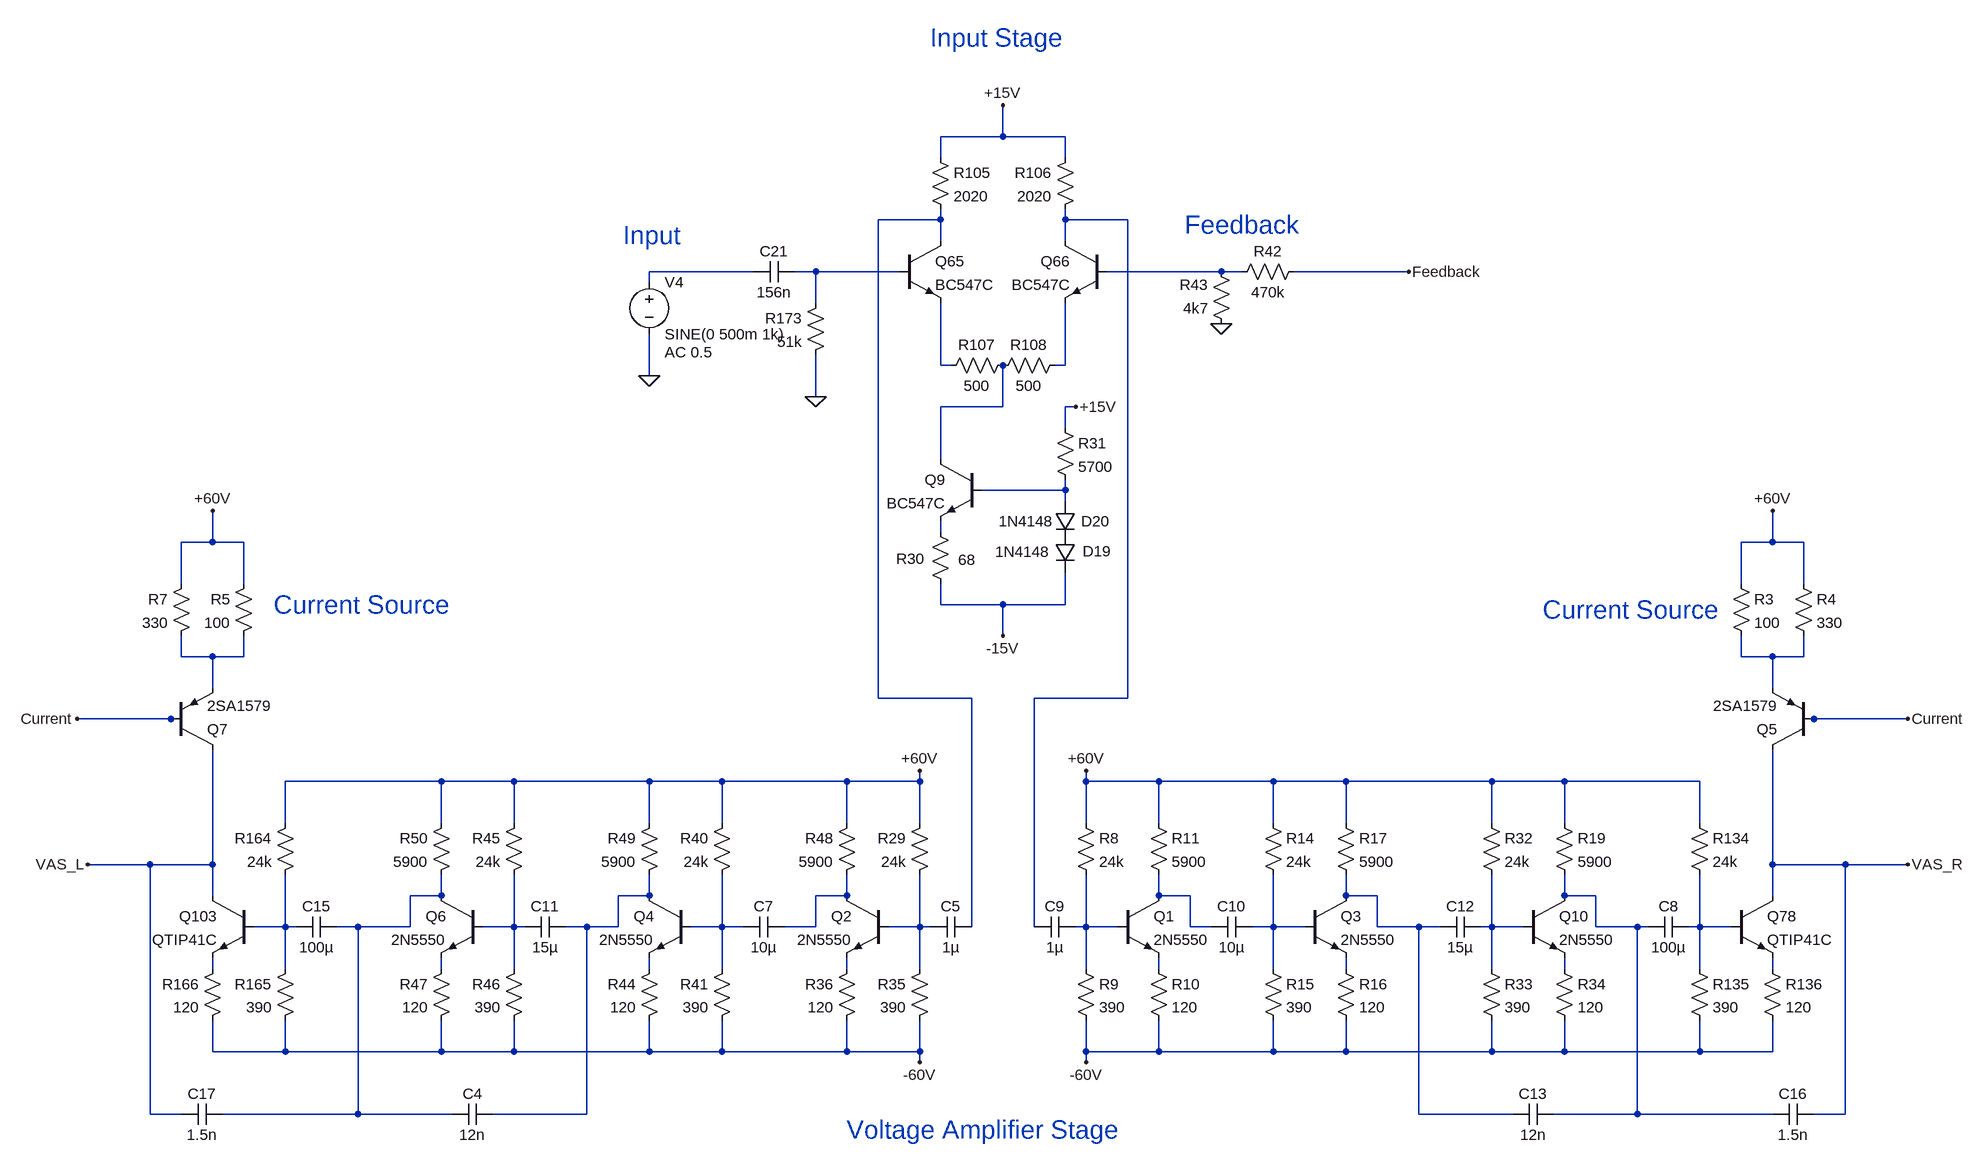
[diagram p0: schematic V12_TEX1.asc]
V12_TEX1.asc, the LTspice schematic file:
Version 4
SHEET 1 16980 8052
WIRE 7760 4400 7760 4352
WIRE 7760 4400 7664 4400
WIRE 7856 4400 7760 4400
WIRE 7664 4432 7664 4400
WIRE 7856 4432 7856 4400
WIRE 7664 4528 7664 4512
WIRE 7664 4528 7568 4528
WIRE 7856 4528 7856 4512
WIRE 7952 4528 7856 4528
WIRE 7664 4560 7664 4528
WIRE 7856 4560 7856 4528
WIRE 7376 4608 7216 4608
WIRE 7472 4608 7440 4608
WIRE 7600 4608 7472 4608
WIRE 8096 4608 7920 4608
WIRE 8128 4608 8096 4608
WIRE 8384 4608 8208 4608
WIRE 7216 4624 7216 4608
WIRE 7472 4656 7472 4608
WIRE 7664 4752 7664 4656
WIRE 7680 4752 7664 4752
WIRE 7856 4752 7856 4656
WIRE 7856 4752 7840 4752
WIRE 7216 4768 7216 4704
WIRE 7472 4800 7472 4736
WIRE 7760 4816 7760 4752
WIRE 7760 4816 7664 4816
WIRE 7872 4816 7856 4816
WIRE 7856 4848 7856 4816
WIRE 7664 4896 7664 4816
WIRE 7856 4944 7856 4928
WIRE 7856 4944 7728 4944
WIRE 7856 4960 7856 4944
WIRE 7664 5008 7664 4992
WIRE 6544 5024 6544 4976
WIRE 6544 5024 6496 5024
WIRE 6592 5024 6544 5024
WIRE 7856 5024 7856 5008
WIRE 8944 5024 8944 4976
WIRE 8944 5024 8896 5024
WIRE 8992 5024 8944 5024
WIRE 6496 5088 6496 5024
WIRE 6592 5088 6592 5024
WIRE 8896 5088 8896 5024
WIRE 8992 5088 8992 5024
WIRE 7664 5120 7664 5088
WIRE 7760 5120 7664 5120
WIRE 7856 5120 7856 5072
WIRE 7856 5120 7760 5120
WIRE 7760 5168 7760 5120
WIRE 6496 5200 6496 5168
WIRE 6544 5200 6496 5200
WIRE 6592 5200 6592 5168
WIRE 6592 5200 6544 5200
WIRE 8896 5200 8896 5168
WIRE 8944 5200 8896 5200
WIRE 8992 5200 8992 5168
WIRE 8992 5200 8944 5200
WIRE 6544 5248 6544 5200
WIRE 8944 5248 8944 5200
WIRE 7568 5264 7568 4528
WIRE 7712 5264 7568 5264
WIRE 7952 5264 7952 4528
WIRE 7952 5264 7808 5264
WIRE 6480 5296 6336 5296
WIRE 6496 5296 6480 5296
WIRE 9008 5296 8992 5296
WIRE 9152 5296 9008 5296
WIRE 6896 5392 6656 5392
WIRE 7008 5392 6896 5392
WIRE 7216 5392 7008 5392
WIRE 7328 5392 7216 5392
WIRE 7520 5392 7328 5392
WIRE 7632 5392 7632 5376
WIRE 7632 5392 7520 5392
WIRE 7888 5392 7888 5376
WIRE 8000 5392 7888 5392
WIRE 8176 5392 8000 5392
WIRE 8288 5392 8176 5392
WIRE 8512 5392 8288 5392
WIRE 8624 5392 8512 5392
WIRE 8832 5392 8624 5392
WIRE 6656 5456 6656 5392
WIRE 6896 5456 6896 5392
WIRE 7008 5456 7008 5392
WIRE 7216 5456 7216 5392
WIRE 7328 5456 7328 5392
WIRE 7520 5456 7520 5392
WIRE 7632 5456 7632 5392
WIRE 7888 5456 7888 5392
WIRE 8000 5456 8000 5392
WIRE 8176 5456 8176 5392
WIRE 8288 5456 8288 5392
WIRE 8512 5456 8512 5392
WIRE 8624 5456 8624 5392
WIRE 8832 5456 8832 5392
WIRE 6448 5520 6352 5520
WIRE 6544 5520 6544 5344
WIRE 6544 5520 6448 5520
WIRE 8944 5520 8944 5344
WIRE 9056 5520 8944 5520
WIRE 9152 5520 9056 5520
WIRE 6544 5568 6544 5520
WIRE 6896 5568 6896 5536
WIRE 6896 5568 6848 5568
WIRE 7216 5568 7216 5536
WIRE 7216 5568 7168 5568
WIRE 7520 5568 7520 5536
WIRE 7520 5568 7472 5568
WIRE 8000 5568 8000 5536
WIRE 8048 5568 8000 5568
WIRE 8288 5568 8288 5536
WIRE 8336 5568 8288 5568
WIRE 8624 5568 8624 5536
WIRE 8672 5568 8624 5568
WIRE 8944 5568 8944 5520
WIRE 6656 5616 6656 5536
WIRE 6656 5616 6608 5616
WIRE 6672 5616 6656 5616
WIRE 6768 5616 6736 5616
WIRE 6848 5616 6848 5568
WIRE 6848 5616 6768 5616
WIRE 7008 5616 7008 5536
WIRE 7008 5616 6960 5616
WIRE 7024 5616 7008 5616
WIRE 7120 5616 7088 5616
WIRE 7168 5616 7168 5568
WIRE 7168 5616 7120 5616
WIRE 7328 5616 7328 5536
WIRE 7328 5616 7280 5616
WIRE 7360 5616 7328 5616
WIRE 7472 5616 7472 5568
WIRE 7472 5616 7424 5616
WIRE 7632 5616 7632 5536
WIRE 7632 5616 7584 5616
WIRE 7648 5616 7632 5616
WIRE 7712 5616 7712 5264
WIRE 7808 5616 7808 5264
WIRE 7888 5616 7888 5536
WIRE 7888 5616 7872 5616
WIRE 7936 5616 7888 5616
WIRE 8048 5616 8048 5568
WIRE 8080 5616 8048 5616
WIRE 8176 5616 8176 5536
WIRE 8176 5616 8144 5616
WIRE 8224 5616 8176 5616
WIRE 8336 5616 8336 5568
WIRE 8400 5616 8336 5616
WIRE 8432 5616 8400 5616
WIRE 8512 5616 8512 5536
WIRE 8512 5616 8496 5616
WIRE 8560 5616 8512 5616
WIRE 8672 5616 8672 5568
WIRE 8736 5616 8672 5616
WIRE 8752 5616 8736 5616
WIRE 8832 5616 8832 5536
WIRE 8832 5616 8816 5616
WIRE 8880 5616 8832 5616
WIRE 6544 5680 6544 5664
WIRE 6656 5680 6656 5616
WIRE 6896 5680 6896 5664
WIRE 7008 5680 7008 5616
WIRE 7216 5680 7216 5664
WIRE 7328 5680 7328 5616
WIRE 7520 5680 7520 5664
WIRE 7632 5680 7632 5616
WIRE 7888 5680 7888 5616
WIRE 8000 5680 8000 5664
WIRE 8176 5680 8176 5616
WIRE 8288 5680 8288 5664
WIRE 8512 5680 8512 5616
WIRE 8624 5680 8624 5664
WIRE 8832 5680 8832 5616
WIRE 8944 5680 8944 5664
WIRE 6544 5808 6544 5760
WIRE 6656 5808 6656 5760
WIRE 6656 5808 6544 5808
WIRE 6896 5808 6896 5760
WIRE 6896 5808 6656 5808
WIRE 7008 5808 7008 5760
WIRE 7008 5808 6896 5808
WIRE 7216 5808 7216 5760
WIRE 7216 5808 7008 5808
WIRE 7328 5808 7328 5760
WIRE 7328 5808 7216 5808
WIRE 7520 5808 7520 5760
WIRE 7520 5808 7328 5808
WIRE 7632 5808 7632 5760
WIRE 7632 5808 7520 5808
WIRE 7888 5808 7888 5760
WIRE 8000 5808 8000 5760
WIRE 8000 5808 7888 5808
WIRE 8176 5808 8176 5760
WIRE 8176 5808 8000 5808
WIRE 8288 5808 8288 5760
WIRE 8288 5808 8176 5808
WIRE 8512 5808 8512 5760
WIRE 8512 5808 8288 5808
WIRE 8624 5808 8624 5760
WIRE 8624 5808 8512 5808
WIRE 8832 5808 8832 5760
WIRE 8832 5808 8624 5808
WIRE 8944 5808 8944 5760
WIRE 8944 5808 8832 5808
WIRE 7632 5824 7632 5808
WIRE 7888 5824 7888 5808
WIRE 6448 5904 6448 5520
WIRE 6496 5904 6448 5904
WIRE 6768 5904 6768 5616
WIRE 6768 5904 6560 5904
WIRE 6912 5904 6768 5904
WIRE 7120 5904 7120 5616
WIRE 7120 5904 6976 5904
WIRE 8400 5904 8400 5616
WIRE 8544 5904 8400 5904
WIRE 8736 5904 8736 5616
WIRE 8736 5904 8608 5904
WIRE 8944 5904 8736 5904
WIRE 9056 5904 9056 5520
WIRE 9056 5904 9008 5904
FLAG 7760 4352 +15V
FLAG 7216 4768 0
FLAG 7472 4800 0
FLAG 7760 5168 -15V
FLAG 7872 4816 +15V
FLAG 7888 5376 +60V
FLAG 7888 5824 -60V
FLAG 8096 4688 0
FLAG 7632 5376 +60V
FLAG 7632 5824 -60V
FLAG 9152 5296 Current
FLAG 6336 5296 Current
FLAG 8944 4976 +60V
FLAG 6544 4976 +60V
FLAG 9152 5520 VAS_R
FLAG 6352 5520 VAS_L
FLAG 8384 4608 Feedback
SYMBOL npn 7600 4560 R0
SYMATTR InstName Q65
SYMATTR Value BC547C
SYMBOL npn 7920 4560 M0
SYMATTR InstName Q66
SYMATTR Value BC547C
SYMBOL res 7648 4416 R0
SYMATTR InstName R105
SYMATTR Value 2020
SYMBOL res 7872 4416 M0
SYMATTR InstName R106
SYMATTR Value 2020
SYMBOL res 7776 4736 R90
WINDOW 0 0 56 VBottom 2
WINDOW 3 32 56 VTop 2
SYMATTR InstName R107
SYMATTR Value 500
SYMBOL res 7856 4736 R90
WINDOW 0 0 56 VBottom 2
WINDOW 3 32 56 VTop 2
SYMATTR InstName R108
SYMATTR Value 500
SYMBOL res 8816 5440 R0
SYMATTR InstName R134
SYMATTR Value 24k
SYMBOL res 8816 5664 R0
SYMATTR InstName R135
SYMATTR Value 390
SYMBOL npn 8880 5568 R0
SYMATTR InstName Q78
SYMATTR Value QTIP41C
SYMBOL res 8928 5664 R0
SYMATTR InstName R136
SYMATTR Value 120
SYMBOL cap 9008 5888 R90
WINDOW 0 0 32 VBottom 2
WINDOW 3 32 32 VTop 2
SYMATTR InstName C16
SYMATTR Value 1.5n
SYMATTR SpiceLine Rser=0.1
SYMBOL res 6672 5440 M0
SYMATTR InstName R164
SYMATTR Value 24k
SYMBOL res 6672 5664 M0
SYMATTR InstName R165
SYMATTR Value 390
SYMBOL npn 6608 5568 M0
SYMATTR InstName Q103
SYMATTR Value QTIP41C
SYMBOL res 6560 5664 M0
SYMATTR InstName R166
SYMATTR Value 120
SYMBOL cap 6496 5888 M90
WINDOW 0 0 32 VBottom 2
WINDOW 3 32 32 VTop 2
SYMATTR InstName C17
SYMATTR Value 1.5n
SYMATTR SpiceLine Rser=0.1
SYMBOL voltage 7216 4608 R0
WINDOW 123 24 124 Left 2
WINDOW 39 0 0 Left 0
SYMATTR Value2 AC 0.5
SYMATTR InstName V4
SYMATTR Value SINE(0 500m 1k)
SYMBOL cap 7440 4592 R90
WINDOW 0 0 32 VBottom 2
WINDOW 3 32 32 VTop 2
SYMATTR InstName C21
SYMATTR Value 156n
SYMATTR SpiceLine Rser=0.1
SYMBOL res 7488 4640 M0
SYMATTR InstName R173
SYMATTR Value 51k
SYMBOL diode 7872 5008 M0
WINDOW 0 -55 30 Left 2
WINDOW 3 39 31 Left 2
SYMATTR InstName D19
SYMATTR Value 1N4148
SYMBOL diode 7872 4960 M0
WINDOW 0 -53 32 Left 2
WINDOW 3 34 32 Left 2
SYMATTR InstName D20
SYMATTR Value 1N4148
SYMBOL npn 7728 4896 M0
SYMATTR InstName Q9
SYMATTR Value BC547C
SYMBOL res 7648 4992 R0
WINDOW 0 -52 58 Left 2
WINDOW 3 43 59 Left 2
SYMATTR InstName R30
SYMATTR Value 68
SYMBOL res 7840 4832 R0
SYMATTR InstName R31
SYMATTR Value 5700
SYMBOL res 7872 5440 R0
SYMATTR InstName R8
SYMATTR Value 24k
SYMBOL res 7872 5664 R0
SYMATTR InstName R9
SYMATTR Value 390
SYMBOL npn 7936 5568 R0
SYMATTR InstName Q1
SYMATTR Value 2N5550
SYMBOL res 7984 5664 R0
SYMATTR InstName R10
SYMATTR Value 120
SYMBOL res 8160 5440 R0
SYMATTR InstName R14
SYMATTR Value 24k
SYMBOL res 8160 5664 R0
SYMATTR InstName R15
SYMATTR Value 390
SYMBOL npn 8224 5568 R0
SYMATTR InstName Q3
SYMATTR Value 2N5550
SYMBOL res 8272 5664 R0
SYMATTR InstName R16
SYMATTR Value 120
SYMBOL res 8496 5440 R0
SYMATTR InstName R32
SYMATTR Value 24k
SYMBOL res 8496 5664 R0
SYMATTR InstName R33
SYMATTR Value 390
SYMBOL npn 8560 5568 R0
SYMATTR InstName Q10
SYMATTR Value 2N5550
SYMBOL res 8608 5664 R0
SYMATTR InstName R34
SYMATTR Value 120
SYMBOL res 8224 4592 R90
WINDOW 0 0 56 VBottom 2
WINDOW 3 32 56 VTop 2
SYMATTR InstName R42
SYMATTR Value 470k
SYMBOL res 8112 4704 R180
WINDOW 0 36 76 Left 2
WINDOW 3 36 40 Left 2
SYMATTR InstName R43
SYMATTR Value 4k7
SYMBOL res 7984 5440 R0
SYMATTR InstName R11
SYMATTR Value 5900
SYMBOL res 8272 5440 R0
SYMATTR InstName R17
SYMATTR Value 5900
SYMBOL res 8608 5440 R0
SYMATTR InstName R19
SYMATTR Value 5900
SYMBOL cap 8544 5888 M90
WINDOW 0 0 32 VBottom 2
WINDOW 3 32 32 VTop 2
SYMATTR InstName C13
SYMATTR Value 12n
SYMATTR SpiceLine Rser=0.1
SYMBOL cap 8752 5600 M90
WINDOW 0 0 32 VBottom 2
WINDOW 3 32 32 VTop 2
SYMATTR InstName C8
SYMATTR Value 100µ
SYMATTR SpiceLine Rser=0.1
SYMBOL cap 6672 5600 M90
WINDOW 0 0 32 VBottom 2
WINDOW 3 32 32 VTop 2
SYMATTR InstName C15
SYMATTR Value 100µ
SYMATTR SpiceLine Rser=0.1
SYMBOL cap 7872 5600 R90
WINDOW 0 0 32 VBottom 2
WINDOW 3 32 32 VTop 2
SYMATTR InstName C9
SYMATTR Value 1µ
SYMBOL cap 8144 5600 R90
WINDOW 0 0 32 VBottom 2
WINDOW 3 32 32 VTop 2
SYMATTR InstName C10
SYMATTR Value 10µ
SYMBOL cap 8496 5600 R90
WINDOW 0 0 32 VBottom 2
WINDOW 3 32 32 VTop 2
SYMATTR InstName C12
SYMATTR Value 15µ
SYMBOL res 7648 5440 M0
SYMATTR InstName R29
SYMATTR Value 24k
SYMBOL res 7648 5664 M0
SYMATTR InstName R35
SYMATTR Value 390
SYMBOL npn 7584 5568 M0
SYMATTR InstName Q2
SYMATTR Value 2N5550
SYMBOL res 7536 5664 M0
SYMATTR InstName R36
SYMATTR Value 120
SYMBOL res 7344 5440 M0
SYMATTR InstName R40
SYMATTR Value 24k
SYMBOL res 7344 5664 M0
SYMATTR InstName R41
SYMATTR Value 390
SYMBOL npn 7280 5568 M0
SYMATTR InstName Q4
SYMATTR Value 2N5550
SYMBOL res 7232 5664 M0
SYMATTR InstName R44
SYMATTR Value 120
SYMBOL res 7024 5440 M0
SYMATTR InstName R45
SYMATTR Value 24k
SYMBOL res 7024 5664 M0
SYMATTR InstName R46
SYMATTR Value 390
SYMBOL npn 6960 5568 M0
SYMATTR InstName Q6
SYMATTR Value 2N5550
SYMBOL res 6912 5664 M0
SYMATTR InstName R47
SYMATTR Value 120
SYMBOL res 7536 5440 M0
SYMATTR InstName R48
SYMATTR Value 5900
SYMBOL res 7232 5440 M0
SYMATTR InstName R49
SYMATTR Value 5900
SYMBOL res 6912 5440 M0
SYMATTR InstName R50
SYMATTR Value 5900
SYMBOL cap 6976 5888 R90
WINDOW 0 0 32 VBottom 2
WINDOW 3 32 32 VTop 2
SYMATTR InstName C4
SYMATTR Value 12n
SYMATTR SpiceLine Rser=0.1
SYMBOL cap 7648 5600 M90
WINDOW 0 0 32 VBottom 2
WINDOW 3 32 32 VTop 2
SYMATTR InstName C5
SYMATTR Value 1µ
SYMBOL cap 7360 5600 M90
WINDOW 0 0 32 VBottom 2
WINDOW 3 32 32 VTop 2
SYMATTR InstName C7
SYMATTR Value 10µ
SYMBOL cap 7024 5600 M90
WINDOW 0 0 32 VBottom 2
WINDOW 3 32 32 VTop 2
SYMATTR InstName C11
SYMATTR Value 15µ
SYMBOL pnp 9008 5344 R180
SYMATTR InstName Q5
SYMATTR Value 2SA1579
SYMBOL res 8880 5072 R0
SYMATTR InstName R3
SYMATTR Value 100
SYMBOL res 8976 5072 R0
SYMATTR InstName R4
SYMATTR Value 330
SYMBOL pnp 6480 5344 M180
SYMATTR InstName Q7
SYMATTR Value 2SA1579
SYMBOL res 6608 5072 M0
SYMATTR InstName R5
SYMATTR Value 100
SYMBOL res 6512 5072 M0
SYMATTR InstName R7
SYMATTR Value 330
TEXT 7520 5928 Left 4 ;Voltage Amplifier Stage
TEXT 7648 4248 Left 4 ;Input Stage
TEXT 8040 4536 Left 4 ;Feedback
TEXT 6912 5120 Right 4 ;Current Source
TEXT 8864 5128 Right 4 ;Current Source
TEXT 7176 4552 Left 4 ;Input

The netlist it stands for:
* V12_TEX1.asc
Q65 N001 N004 N006 0 BC547C
Q66 N002 N005 N007 0 BC547C
R105 +15V N001 2020
R106 +15V N002 2020
R107 N008 N006 500
R108 N007 N008 500
R134 +60V N027 24k
R135 N027 -60V 390
Q78 VAS_R N027 N035 0 QTIP41C
R136 N035 -60V 120
C16 VAS_R N019 1.5n Rser=0.1
R164 +60V N020 24k
R165 N020 -60V 390
Q103 VAS_L N020 N028 0 QTIP41C
R166 N028 -60V 120
C17 VAS_L N014 1.5n Rser=0.1
V4 N003 0 SINE(0 500m 1k) AC 0.5
C21 N004 N003 156n Rser=0.1
R173 N004 0 51k
D19 N011 -15V 1N4148
D20 N009 N011 1N4148
Q9 N008 N009 N010 0 BC547C
R30 N010 -15V 68
R31 +15V N009 5700
R8 +60V N024 24k
R9 N024 -60V 390
Q1 N017 N024 N032 0 2N5550
R10 N032 -60V 120
R14 +60V N025 24k
R15 N025 -60V 390
Q3 N018 N025 N033 0 2N5550
R16 N033 -60V 120
R32 +60V N026 24k
R33 N026 -60V 390
Q10 N019 N026 N034 0 2N5550
R34 N034 -60V 120
R42 Feedback N005 470k
R43 0 N005 4k7
R11 +60V N017 5900
R17 +60V N018 5900
R19 +60V N019 5900
C13 N018 N019 12n Rser=0.1
C8 N019 N027 100µ Rser=0.1
C15 N020 N014 100µ Rser=0.1
C9 N024 N002 1µ
C10 N025 N017 10µ
C12 N026 N018 15µ
R29 +60V N023 24k
R35 N023 -60V 390
Q2 N016 N023 N031 0 2N5550
R36 N031 -60V 120
R40 +60V N022 24k
R41 N022 -60V 390
Q4 N015 N022 N030 0 2N5550
R44 N030 -60V 120
R45 +60V N021 24k
R46 N021 -60V 390
Q6 N014 N021 N029 0 2N5550
R47 N029 -60V 120
R48 +60V N016 5900
R49 +60V N015 5900
R50 +60V N014 5900
C4 N015 N014 12n Rser=0.1
C5 N023 N001 1µ
C7 N022 N016 10µ
C11 N021 N015 15µ
Q5 VAS_R Current N013 0 2SA1579
R3 +60V N013 100
R4 +60V N013 330
Q7 VAS_L Current N012 0 2SA1579
R5 +60V N012 100
R7 +60V N012 330
.model D D
.lib standard.dio
.model NPN NPN
.model PNP PNP
.lib standard.bjt
* Voltage Amplifier Stage
* Input Stage
* Feedback
* Current Source
* Current Source
* Input
.backanno
.end